# EAGLE schematic 1uprava1 (EAGLE 9.5.2)
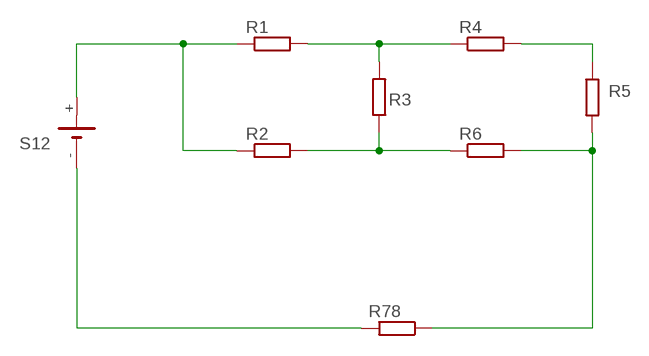
[diagram p0: schematic, sheet 1]

## Parts
R1  680R  R-EU_0204/7  [0204/7]
R2  600R  R-EU_0204/7  [0204/7]
R3  260R  R-EU_0204/7  [0204/7]
R4  310R  R-EU_0204/7  [0204/7]
R5  575R  R-EU_0204/7  [0204/7]
R6  870R  R-EU_0204/7  [0204/7]
R78  355R  R-EU_0204/7  [0204/7]
S12  135V  CH291-1220LF  [CH291-1220LF]

## Nets
N$1: R1.1 R2.1 S12.+
N$2: R1.2 R3.2 R4.1
N$3: R4.2 R5.1
N$4: R5.2 R6.2 R78.1
N$5: R2.2 R3.1 R6.1
N$7: R78.2 S12.-

## Library data of the parts
R1-R6 R78 = rcl:R-EU_: RESISTOR, European symbol; SPICEPREFIX: R
S12 = battery:CH291-1220LF: Battery Holder, SMT, 12mm multicomp PART NO. CH291-1220LF Source: Data sheet <http://www.farnell.com/datasheets/1505860.pdf>